# Altium schematic sheet 1A18J1_1A21J1 A.SchDoc: Cable Assembly
size A; Date: 1/1/17; CompanyName: National Center for Atmospheric Research; DrawnBy: Rich Erickson; Engineer: 4/21/17; Organization: Earth Observing Laboratory; Address1: 3450 Mitchell Lane; Address2: FL1; Address3: 3090 Center Green Dr.; Address4: Boulder, CO. 80301; DocumentNumber: 1A18J1_1A21J1(AC PWR 120V); Revision: A; SheetNumber: 1; SheetTotal: 1; Department: Remote Sensing Facility; PageSetup: Record=PageOptions|CenterHorizontal=True|CenterVertical=True|PrintScale=1.07|XCorrection=1.00|YCorrection=1.00|PrintKind=1|BorderSize=5000000|LeftOffset=0|BottomOffset=0|Orientation=2|PaperLength=1000|PaperWidth=1000|Scale=100|PaperSource=273|PrintQuality=600|MediaType=1|DitherType=10|PrintScaleMode=1|PaperKind=Letter|PaperIndex=1; ModifiedDate: 7/17/97; ImagePath: 4/21/17; ProjectName: Ka Band; Application_BuildNumber: 5
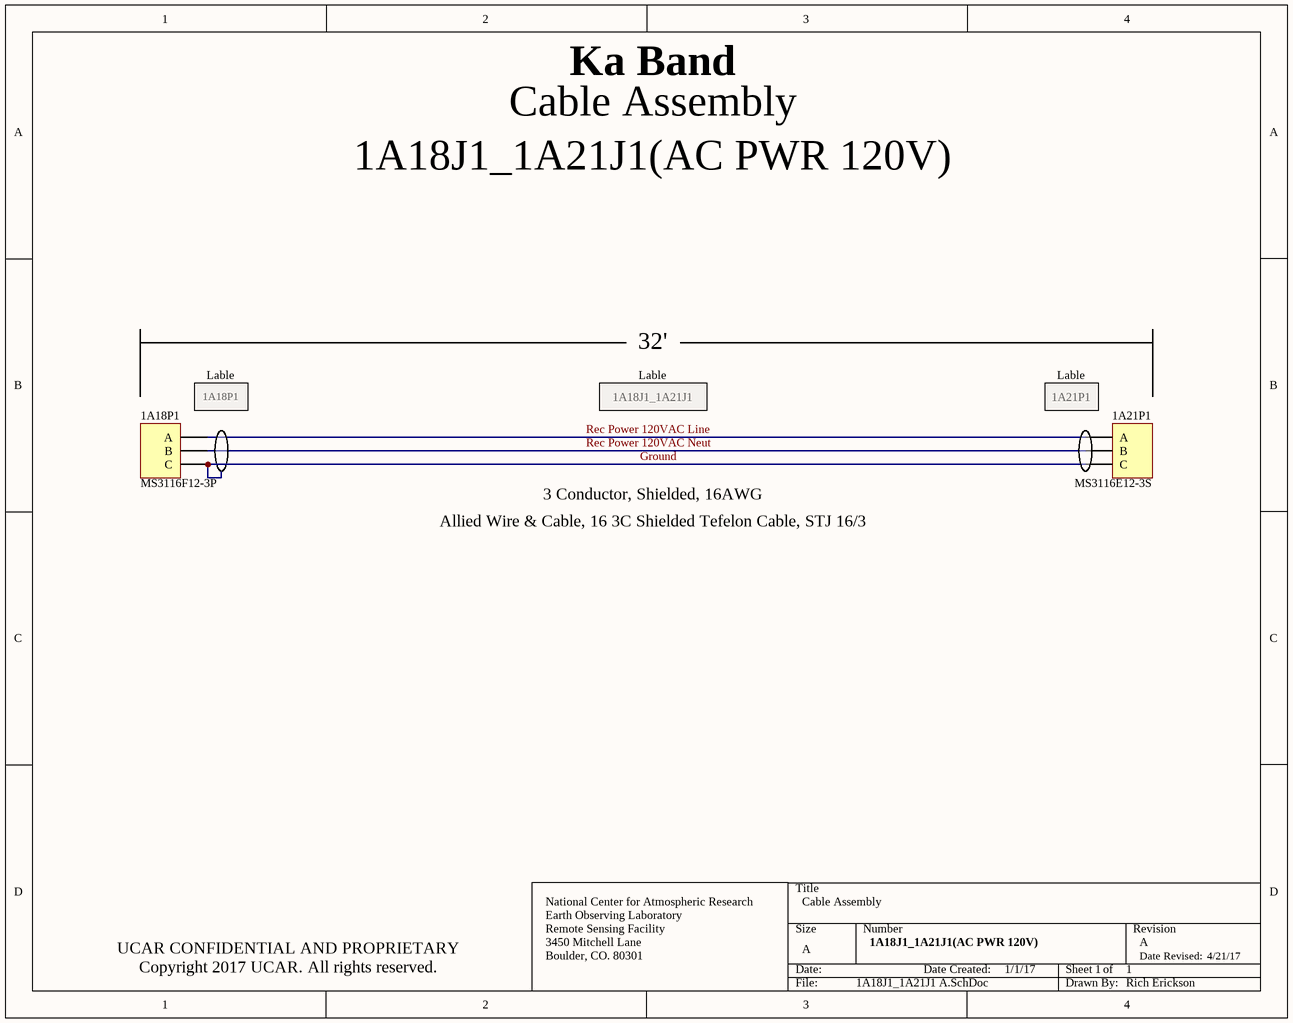
[diagram p0: 1A18J1_1A21J1 A.SchDoc]

## Parts
1A18P1  MS3116F12-3P  [HDR1X3]
1A21P1  MS3116E12-3S  [HDR1X3]

## Nets
Ground: 1A18P1.3(C) 1A21P1.3(C)
Rec Power 120VAC Line: 1A18P1.1(A) 1A21P1.1(A)
Rec Power 120VAC Neut: 1A18P1.2(B) 1A21P1.2(B)

## Notes on the sheet
- 32'
- (near 1A18P1) 1A18P1
- Lable
- 1A18J1_1A21J1
- (near 1A21P1) 1A21P1
- 3 Conductor, Shielded, 16AWG
- Allied Wire & Cable, 16 3C Shielded Tefelon Cable, STJ 16/3
- UCAR CONFIDENTIAL AND PROPRIETARY
  Copyright 2017 UCAR. All rights reserved.
- Date Created:
- Date Revised:

## Library data of the parts
1A18P1 1A21P1 = Header 3: Header, 3-Pin; LatestRevisionDate: 17-Jul-2002; LatestRevisionNote: Re-released for DXP Platform.; Publisher: Altium Limited